# EAGLE design schematic (EAGLE 7.6.0)
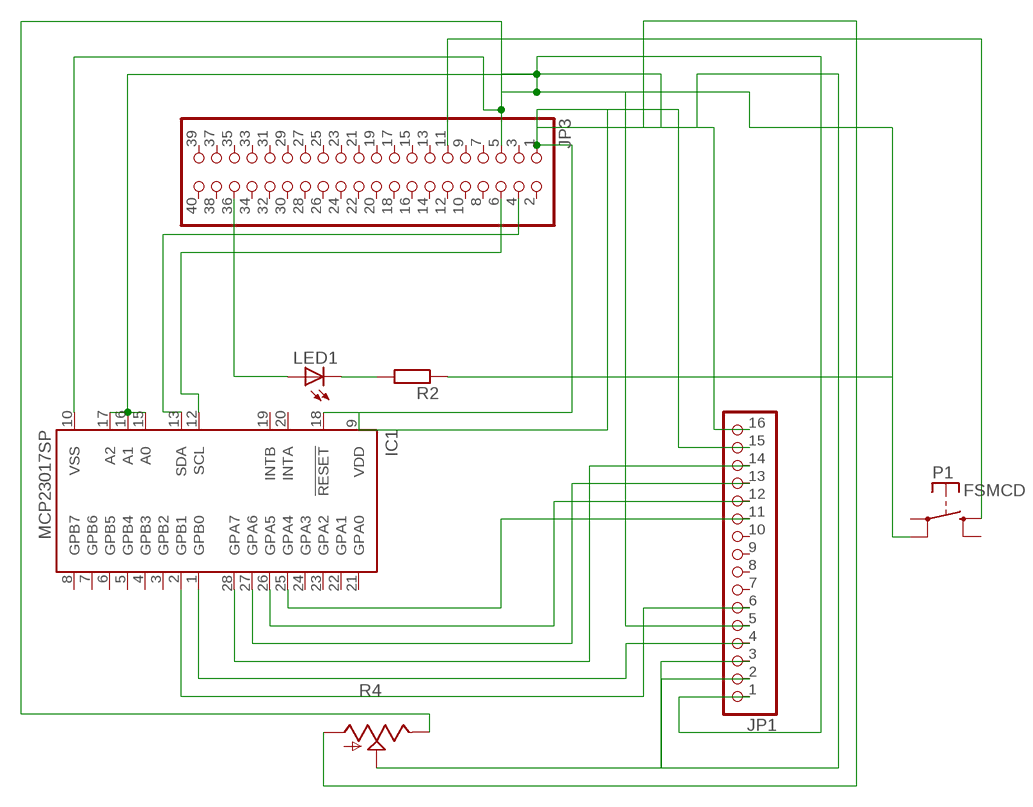
[diagram p0: schematic, sheet 1]

## Parts
IC1  MCP23017SP  [DIL28-3]
JP1  PINHD-1X16  [1X16]
JP3  PINHD-2X20  [2X20]
LED1  LED5MM  [LED5MM]
P1  FSMCD  [FSMCD]
R2  R-EU_0207/10  [0207/10]
R4  TRIM_US-RS3  [RS3]

## Nets
N$1: IC1.25(GPA4) JP1.11
N$2: IC1.26(GPA5) JP1.12
N$3: IC1.27(GPA6) JP1.13
N$4: IC1.28(GPA7) JP1.14
N$5: JP1.3 R4.S
N$6: IC1.1(GPB0) JP1.4
N$7: IC1.2(GPB1) JP1.6
N$8: IC1.9(VDD) IC1.18(!RESET) JP1.15 JP3.1
N$9: LED1.K(C) R2.2
N$10: IC1.12(SCL) JP3.6
N$11: IC1.13(SDA) JP3.4
N$12: JP3.36 LED1.A
N$13: JP3.11 P1.P$3(S)
N$14: JP1.2 R4.A
N$15: IC1.10(VSS) IC1.15(A0) IC1.16(A1) IC1.17(A2) JP1.1 JP1.5 JP1.16 JP3.5 P1.P$2(P) R2.1 R4.E
Unconnected: IC1.3(GPB2) IC1.4(GPB3) IC1.5(GPB4) IC1.6(GPB5) IC1.7(GPB6) IC1.8(GPB7) IC1.19(INTB) IC1.20(INTA) IC1.21(GPA0) IC1.22(GPA1) IC1.23(GPA2) IC1.24(GPA3) JP1.7 JP1.8 JP1.9 JP1.10 JP3.2 JP3.3 JP3.7 JP3.8 JP3.9 JP3.10 JP3.12 JP3.13 JP3.14 JP3.15 JP3.16 JP3.17 JP3.18 JP3.19 JP3.20 JP3.21 JP3.22 JP3.23 JP3.24 JP3.25 JP3.26 JP3.27 JP3.28 JP3.29 JP3.30 JP3.31 JP3.32 JP3.33 JP3.34 JP3.35 JP3.37 JP3.38 JP3.39 JP3.40 P1.P$1(P) P1.P$4(S)

## Library data of the parts
IC1 = microchip:MCP23017: http://ww1.microchip.com/downloads/en/DeviceDoc/21952a.pdf Source: http://ww1.microchip.com/downloads/en/DeviceDoc/21952a.pdf; MF: MICROCHIP; MPN: MCP23017-E/SP; OC_FARNELL: 1332088; OC_NEWARK: 31K2959
JP1 = pinhead:PINHD-1X16: PIN HEADER
JP3 = pinhead:PINHD-2X20: PIN HEADER
LED1 = adafruit:LED: LED OSRAM: - CHIPLED LG R971, LG N971, LY N971, LG Q971, LY Q971, LO R971, LY R971 LH N974, LH R974 LS Q976, LO Q976, LY Q976 LO Q996 - Hyper CHIPLED LW Q18S LB Q993, LB Q99A, LB R99A - SideLED LS A670, LO A670, LY A670, LG A670, LP A670 LB A673, LV A673, LT A673, LW A673 LH A674 LY A675 LS A676, LA A676, LO A676, LY A676, LW A676 LS A679, LY A679, LG A679 - Hyper Micro SIDELED® LS Y876, LA Y876, LO Y876, LY Y876 LT Y87S - SmartLED LW L88C, LW L88S LB L89C, LB L89S, LG L890 LS L89K, LO L89K, LY L89K LS L896, LA L896, LO L896, LY L896 - TOPLED LS T670, LO T670, LY T670, LG T670, LP T670 LSG T670, LSP T670, LSY T670, LOP T670, LYG T670 LG T671, LOG T671, LSG T671 LB T673, LV T673, LT T673, LW T673 LH T674 LS T676, LA T676, LO T676, LY T676, LB T676, LH T676, LSB T676, LW T676 LB T67C, LV T67C, LT T67C, LS T67K, LO T67K, LY T67K, LW E67C LS E67B, LA E67B, LO E67B, LY E67B, LB E67C, LV E67C, LT E67C LW T67C LS T679, LY T679, LG T679 LS T770, LO T770, LY T770, LG T770, LP T770 LB T773, LV T773, LT T773, LW T773 LH T774 LS E675, LA E675, LY E675, LS T675 LS T776, LA T776, LO T776, LY T776, LB T776 LHGB T686 LT T68C, LB T68C - Hyper Mini TOPLED® LB M676 - Mini TOPLED Santana® LG M470 LS M47K, LO M47K, LY M47K Source: http://www.osram.convergy.de/
P1 = switch-misc:FSMCD: TYCO SWITCH
R2 = resistor:R-EU_: RESISTOR, European symbol
R4 = pot:TRIM_US-: POTENTIOMETER

## Board
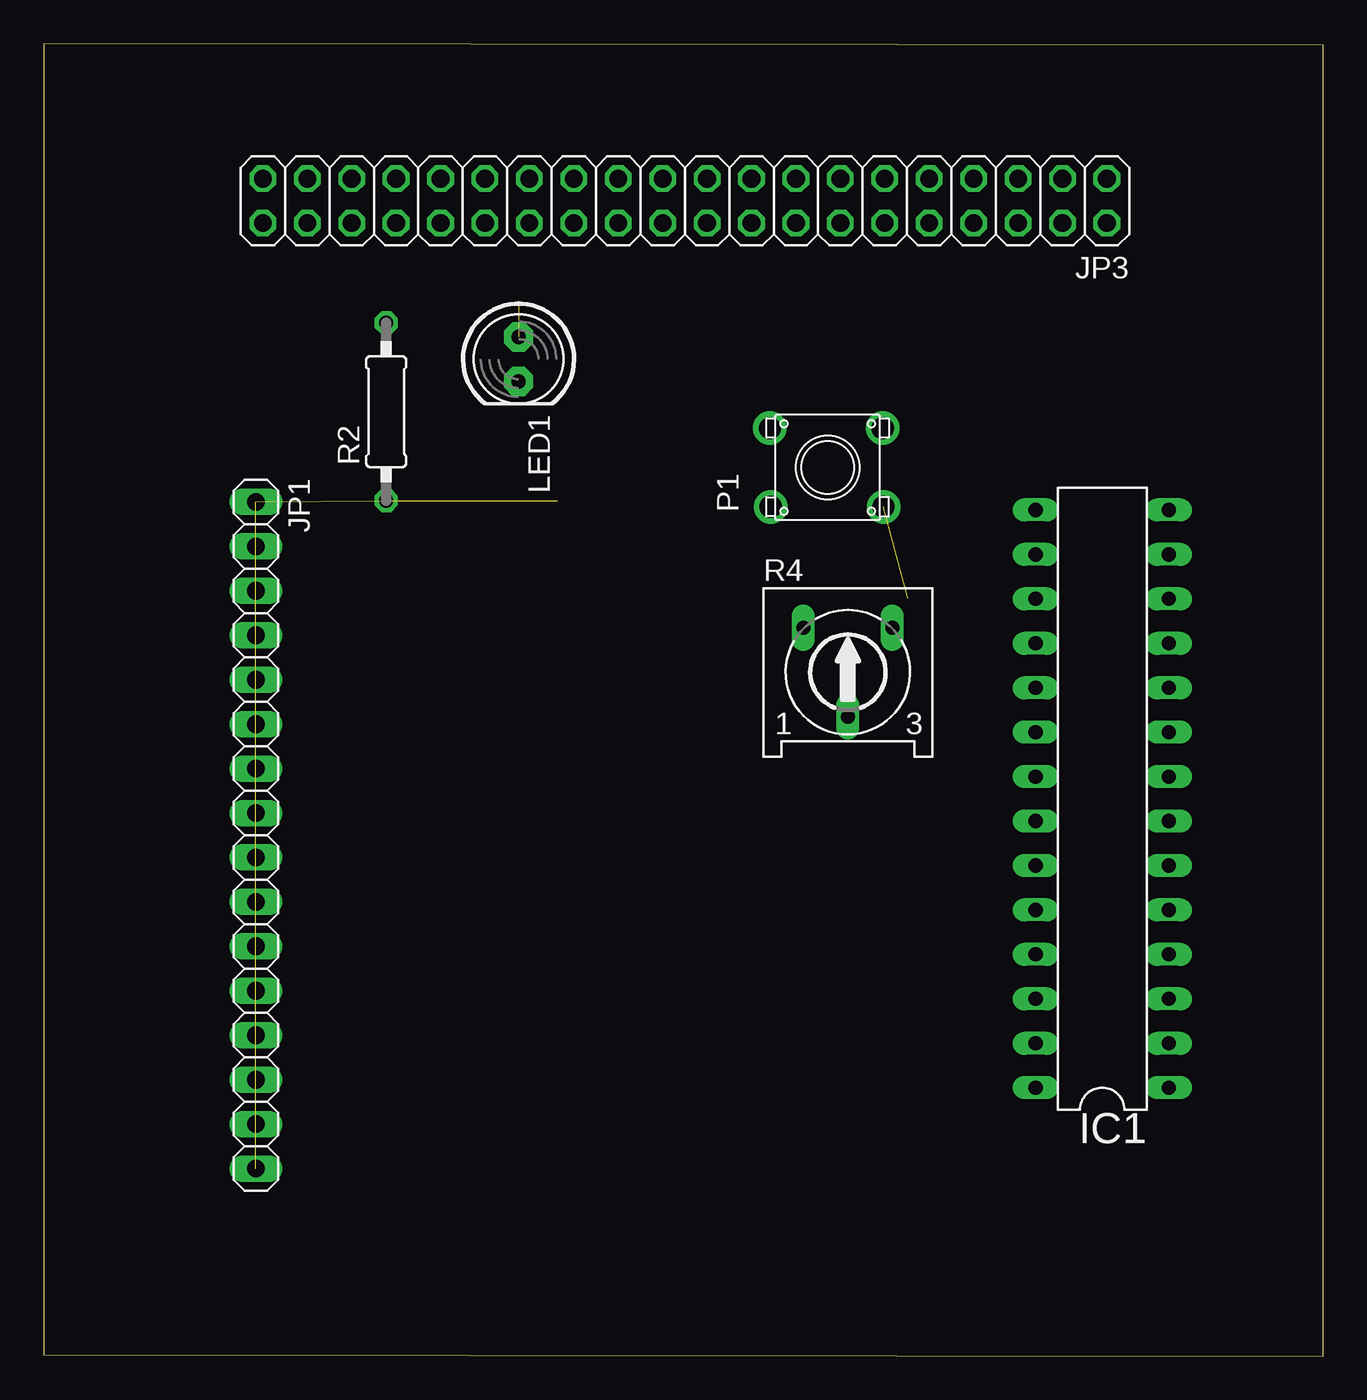
[diagram p1: board, top side]
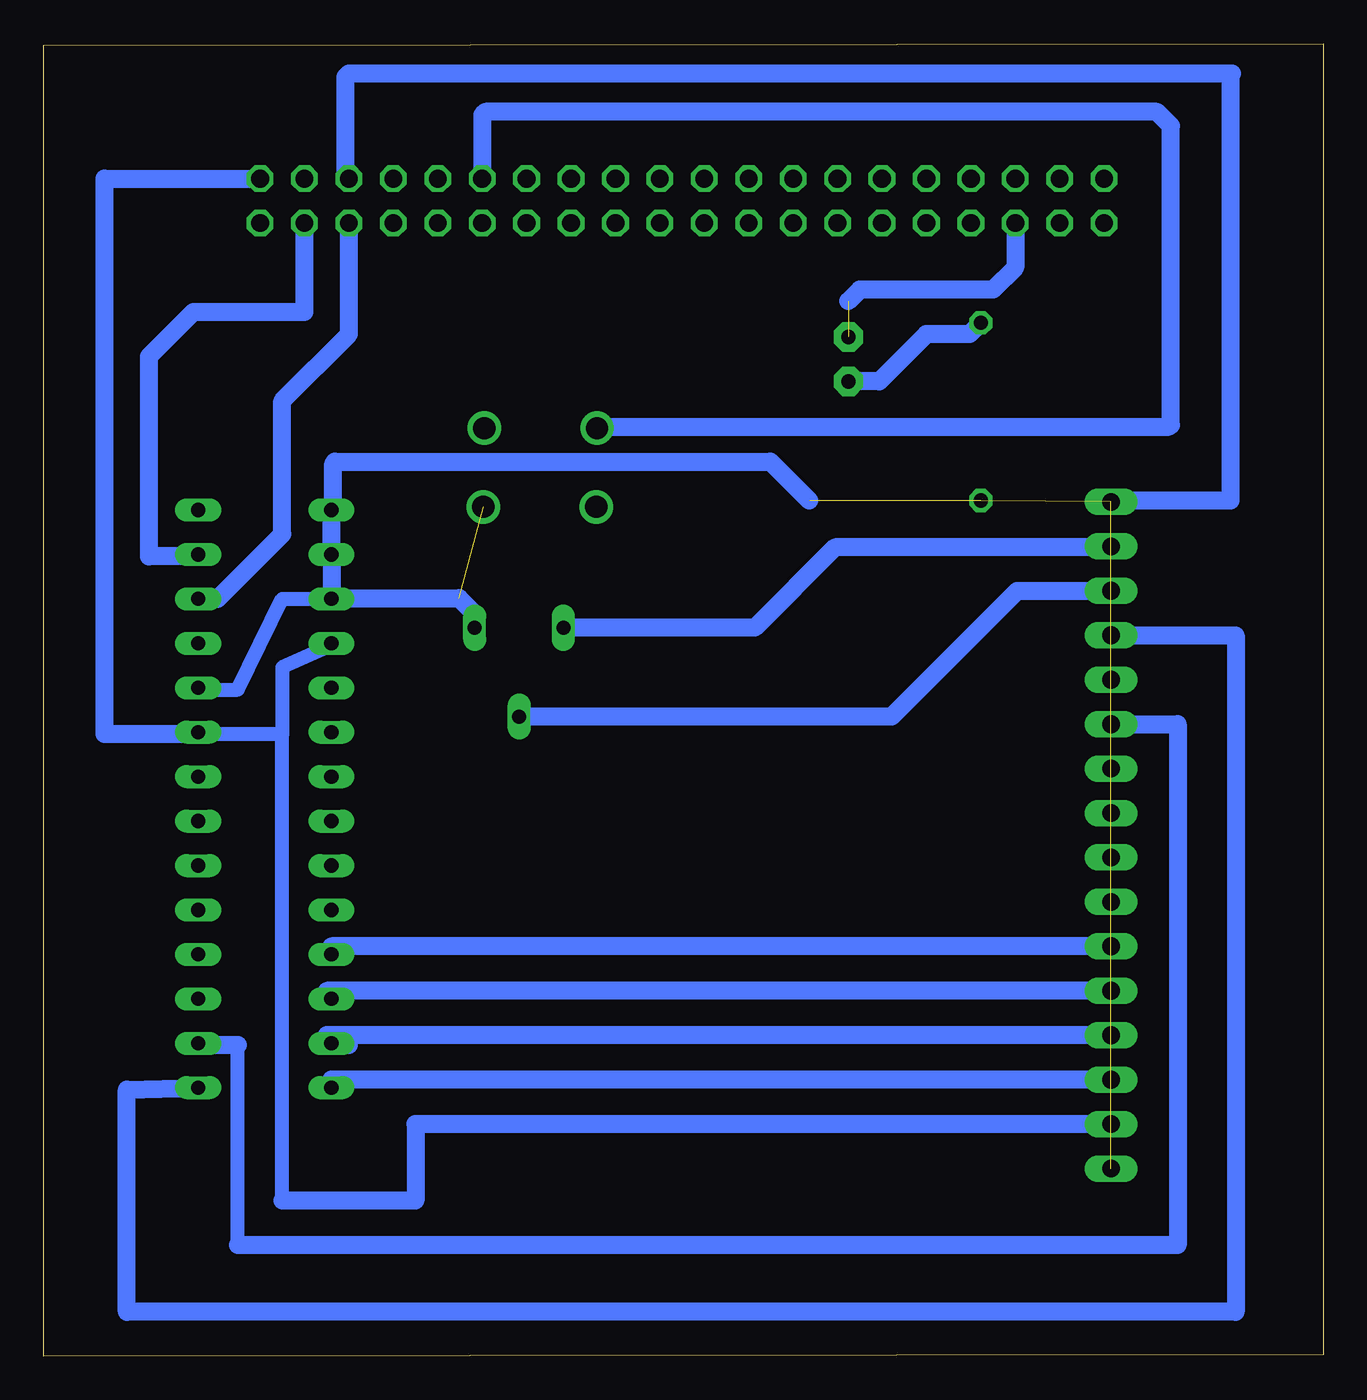
[diagram p2: board, bottom side, seen from below]

Size 73.16 x 75.02 mm. Coordinates in mm from the lower left corner, seen from the top.
Outline: 0,0.1 73.16,0 73.16,74.92 0,75.02 0,0.1
Copper layers (1*16): Top 0.035mm / dielectric 1.5mm / Bottom 0.035mm
Design rules "default": minimum track width 10mil, minimum drill 24mil, track to track 8mil, track to pad 8mil, pad to pad 8mil, via to via 8mil, smd to smd 8mil, copper to edge 40mil, drill to drill 8mil, minimum pad ring 10mil, minimum via ring 8mil, stop-mask expansion 4mil, vias tented up to drill 0mil, thermal gap 10mil

### Footprints (pad centres in the part's own frame; a part is rotated, then mirrored left to right if it is on the bottom)
DIL28-3 = drill 0.813 long: 1 -16.51,-3.81; 2 -13.97,-3.81; 3 -11.43,-3.81; 4 -8.89,-3.81; 5 -6.35,-3.81; 6 -3.81,-3.81; 7 -1.27,-3.81; 8 1.27,-3.81; 9 3.81,-3.81; 10 6.35,-3.81; 11 8.89,-3.81; 12 11.43,-3.81; 13 13.97,-3.81; 14 16.51,-3.81; 15 16.51,3.81; 16 13.97,3.81; 17 11.43,3.81; 18 8.89,3.81; 19 6.35,3.81; 20 3.81,3.81; 21 1.27,3.81; 22 -1.27,3.81; 23 -3.81,3.81; 24 -6.35,3.81; 25 -8.89,3.81; 26 -11.43,3.81; 27 -13.97,3.81; 28 -16.51,3.81
1X16 = drill 1.016 long: 1 -19.05,0; 2 -16.51,0; 3 -13.97,0; 4 -11.43,0; 5 -8.89,0; 6 -6.35,0; 7 -3.81,0; 8 -1.27,0; 9 1.27,0; 10 3.81,0; 11 6.35,0; 12 8.89,0; 13 11.43,0; 14 13.97,0; 15 16.51,0; 16 19.05,0
2X20 = drill 1.016 octagon: 1 -24.13,-1.27; 2 -24.13,1.27; 3 -21.59,-1.27; 4 -21.59,1.27; 5 -19.05,-1.27; 6 -19.05,1.27; 7 -16.51,-1.27; 8 -16.51,1.27; 9 -13.97,-1.27; 10 -13.97,1.27; 11 -11.43,-1.27; 12 -11.43,1.27; 13 -8.89,-1.27; 14 -8.89,1.27; 15 -6.35,-1.27; 16 -6.35,1.27; 17 -3.81,-1.27; 18 -3.81,1.27; 19 -1.27,-1.27; 20 -1.27,1.27; 21 1.27,-1.27; 22 1.27,1.27; 23 3.81,-1.27; 24 3.81,1.27; 25 6.35,-1.27; 26 6.35,1.27; 27 8.89,-1.27; 28 8.89,1.27; 29 11.43,-1.27; 30 11.43,1.27; 31 13.97,-1.27; 32 13.97,1.27; 33 16.51,-1.27; 34 16.51,1.27; 35 19.05,-1.27; 36 19.05,1.27; 37 21.59,-1.27; 38 21.59,1.27; 39 24.13,-1.27; 40 24.13,1.27
LED5MM = drill 0.813 pad 1.676 octagon: A -1.27,0; K 1.27,0
FSMCD = drill 1.27: P$1 -2.25,3.25; P$2 -2.25,-3.2; P$3 2.25,3.3; P$4 2.25,-3.15
0207/10 = drill 0.813 octagon: 1 -5.08,0; 2 5.08,0
RS3 = drill 0.813 long: A -2.54,2.54; E 2.54,2.54; S 0,-2.54

### Placement (x,y rotation side)
IC1  60.52,31.86 90 top
JP1  12.13,29.78 270 top
JP3  36.66,66.04 180 top
LED1  27.15,56.99 270 top
P1  44.82,50.8 90 top
R2  19.58,53.99 90 top
R4  45.98,39.1 0 top

### Tracks (layer width: path | path; a pad name or v marks a point on that pad's centre or on a via)
N$1
  Bottom 1.016: JP1.11 56.71,23.43 IC1.25
N$2
  Bottom 1.016: JP1.12 56.98,20.89 56.98,20.32 56.71,20.32 IC1.26
N$3
  Bottom 1.016: JP1.13 56.98,18.35 56.98,17.78 56.71,17.78 | 55.71,17.78 56.71,17.78 | 56.71,17.78 IC1.27
N$4
  Bottom 1.016: 56.98,15.24 IC1.28 56.71,15.81 JP1.14
N$5
  Bottom 1.016: JP1.3 12.35,43.73 17.51,43.73 24.68,36.56 R4.S
N$6
  Bottom 1.016: IC1.1 68.41,15.24 68.41,2.54 5.01,2.54 5.01,41.21 JP1.4
N$7
  Bottom 0.813: 62.06,6.35 62.06,17.78
  Bottom 1.016: JP1.6 8.32,36.13 8.32,6.35 62.06,6.35 | 62.06,17.78 64.33,17.78 IC1.2
N$8
  Bottom 0.813: 59.52,8.89 59.52,35.56 | 59.52,35.56 64.33,35.56 | 56.71,40.64 59.52,39.37 59.52,35.56
  Bottom 1.016: JP1.15 51.9,13.27 51.9,8.89 59.52,8.89 | IC1.9 64.33,35.56 69.68,35.56 69.68,67.31 JP3.1 | IC1.18 56.71,40.64
N$9
  Bottom 1.016: R2.2 20.23,58.42 22.69,58.42 25.39,55.72 LED1.K
N$10
  Bottom 1.016: IC1.12 63.22,43.29 59.52,46.99 59.52,54.61 55.71,58.42 JP3.6
N$11
  Bottom 1.016: IC1.13 arc90 64.44,45.72 67.14,45.72 67.14,57.15 64.6,59.69 58.25,59.69 JP3.4
N$12  (1 unrouted)
  Bottom 1.016: JP3.36 17.61,62.23 18.88,60.96 26.5,60.96 27.15,60.31
N$13
  Bottom 1.016: P1.P$3 41.44,53.13 8.81,53.13 8.71,53.23 8.71,70.33 9.51,71.13 47.91,71.13 48.09,70.95 JP3.11
N$14
  Bottom 1.016: JP1.2 11.99,46.23 27.91,46.23 32.5,41.64 R4.A
N$15  (5 unrouted)
  Bottom 0.406: IC1.10 64.33,38.1
  Bottom 0.813: 64.33,38.1 62.06,38.1 59.52,43.29 IC1.17
  Bottom 1.016: JP1.1 11.83,48.91 5.31,48.91 5.31,73.23 5.21,73.33 55.71,73.33 55.91,73.13 55.91,67.51 JP3.5 | 29.39,48.91 31.61,51.13 56.51,51.13 56.61,51.03 56.61,48.47 IC1.15 IC1.16 IC1.17 56.67,43.33 49.41,43.33 48.52,42.44 R4.E